# EAGLE design PCB-TLY-LAMP_v10-18 (EAGLE 7.7.0)
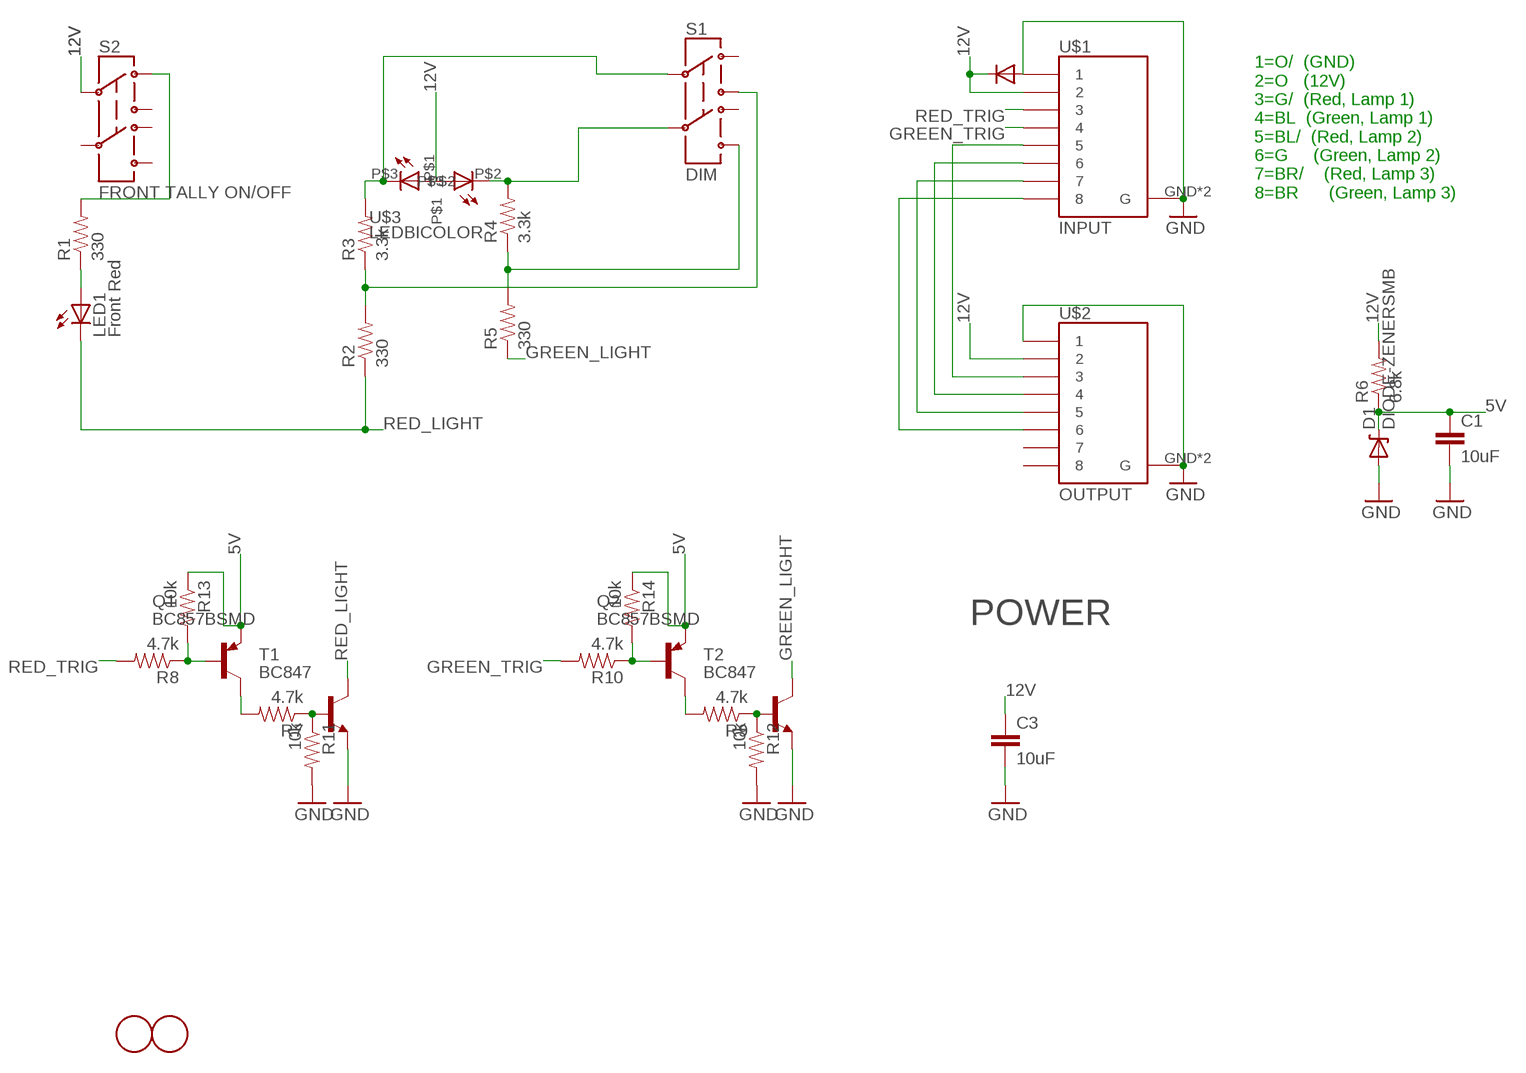
[diagram p0: schematic, sheet 1]

## Parts
C1  10uF  CAP0805  [0805]
C3  10uF  CAP0805  [0805]
D1  DIODE-ZENERSMB  [SMB-DIODE]
LED1  Front Red  LED20  [LED20]
Q1  BC857BSMD  [SOT23-BEC]
Q2  BC857BSMD  [SOT23-BEC]
R1  330  RESISTOR0603-RES  [0603-RES]
R2  330  RESISTOR0603-RES  [0603-RES]
R3  3.3k  RESISTOR0603-RES  [0603-RES]
R4  3.3k  RESISTOR0603-RES  [0603-RES]
R5  330  RESISTOR0603-RES  [0603-RES]
R6  6.8k  RESISTOR0603-RES  [0603-RES]
R7  4.7k  RESISTOR0603-RES  [0603-RES]
R8  4.7k  RESISTOR0603-RES  [0603-RES]
R9  4.7k  RESISTOR0603-RES  [0603-RES]
R10  4.7k  RESISTOR0603-RES  [0603-RES]
R11  10k  RESISTOR0603-RES  [0603-RES]
R12  10k  RESISTOR0603-RES  [0603-RES]
R13  10k  RESISTOR0603-RES  [0603-RES]
R14  10k  RESISTOR0603-RES  [0603-RES]
S1  DIM  SWITCH-DPDTPTH1  [TECONNECTIVITY-DPDT]
S2  FRONT TALLY ON/OFF  SWITCH-DPDTPTH1  [TECONNECTIVITY-DPDT]
T1  BC847  [SOT23]
T2  BC847  [SOT23]
U$1  INPUT  RJ45-8_GND  [RJ45-8_GND]
U$2  OUTPUT  RJ45-8_GND  [RJ45-8_GND]
U$3  LEDBICOLOR  [LEDBICOLOR]
U$4  FIDUCIAL  [FIDUCIAL_1MM]
U$5  FIDUCIAL  [FIDUCIAL_1MM]

## Nets
5V: C1.1 D1.C Q1.E Q2.E R6.1 R13.1 R14.1
12V [POWER]: C3.1 R6.2 S2.P$2 U$1.2 U$2.2 U$3.P$1
GND [POWER]: C1.2 C3.2 D1.A R11.2 R12.2 T1.2(E) T2.2(E) U$1.1 U$1.GND1(G) U$1.GND(G) U$2.1 U$2.GND1(G) U$2.GND(G)
GREEN_LIGHT [POWER]: R5.1 T2.3(C)
GREEN_TRIG: R10.2 U$1.4
N$1 [POWER]: R1.2 S2.P$1
N$2 [POWER]: LED1.P$1(A) R1.1
N$3 [POWER]: R2.2 R3.1 S1.P$3
N$4 [POWER]: R4.1 R5.2 S1.P$6
N$5 [POWER]: R4.2 S1.P$5 U$3.P$2
N$6 [POWER]: R3.2 S1.P$2 U$3.P$3
N$7: U$1.5 U$2.3
N$8: U$1.6 U$2.4
N$9: R7.1 R11.1 T1.1(B)
N$10: Q1.C R7.2
N$11: U$1.7 U$2.5
N$12: U$1.8 U$2.6
N$13: R9.1 R12.1 T2.1(B)
N$14: Q2.C R9.2
N$15: Q2.B R10.1 R14.2
N$16: Q1.B R8.1 R13.2
RED_LIGHT [POWER]: LED1.P$2(C) R2.1 T1.3(C)
RED_TRIG: R8.2 U$1.3
Unconnected: S1.P$1 S1.P$4 S2.P$3 S2.P$4 S2.P$5 S2.P$6 U$2.7 U$2.8

## Notes on the sheet
- 1=O/  (GND)
  2=O   (12V)
  3=G/  (Red, Lamp 1)
  4=BL  (Green, Lamp 1)
  5=BL/  (Red, Lamp 2)
  6=G     (Green, Lamp 2)
  7=BR/    (Red, Lamp 3)
  8=BR      (Green, Lamp 3)
- POWER

## Library data of the parts
C1 C3 = SparkFun:CAP: Capacitor Standard 0603 ceramic capacitor, and 0.1" leaded capacitor.
D1 = SparkFun:DIODE-ZENER: Zener Diode Production Part - 8199 3.4V Zener Voltage
LED1 = SKAARHOJ:LED20: KINGBRIGHT 20MM BIG LAMP
Q1 Q2 = transistor-pnp:BC857*: PNP Transistror
R1-R14 = SparkFun:RESISTOR: Resistor Basic schematic elements and footprints for 0603, 1206, and PTH resistors.
S1 S2 = SKAARHOJ:SWITCH-DPDT: DPDT Version of the COM-00597
T1 T2 = transistor:BC847: NPN TRANSISTOR
U$1 U$2 = SKAARHOJ:RJ45-8_GND
U$3 = SKAARHOJ:LEDBICOLOR: L.C.LED N810TGLR2D 10mm Diffused Bicolor Led Lamp (Anode)
U$4 U$5 = adafruit:FIDUCIAL: For use by pick and place machines to calibrate the vision/machine, 1mm By microbuilder.eu

## Net classes
0 default: width 0.254 mm, drill 0.559 mm, clearance 0.203 mm
1 POWER: width 0.508 mm, drill 0.686 mm, clearance 0.203 mm

## Board
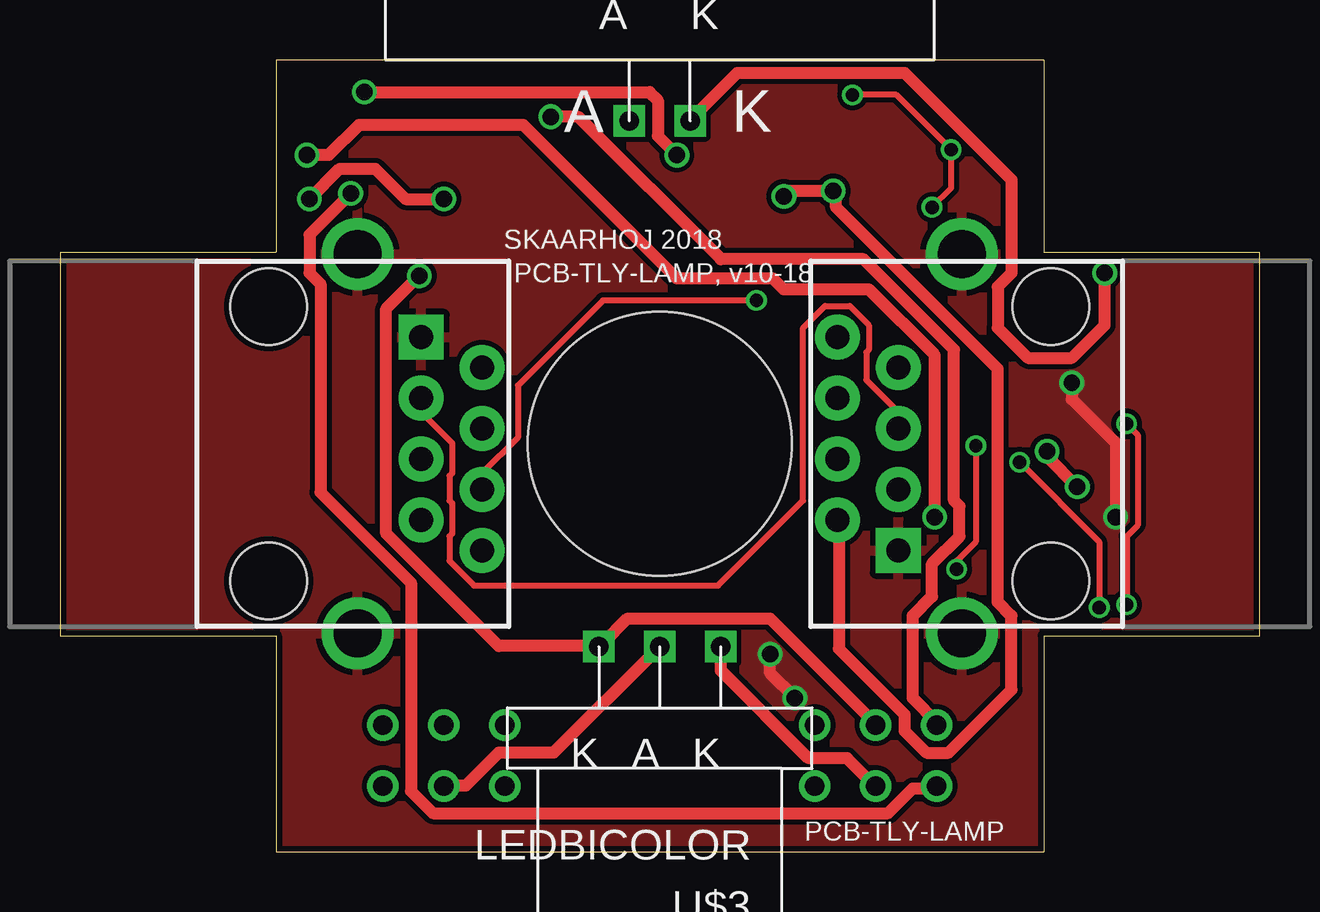
[diagram p1: board, top side]
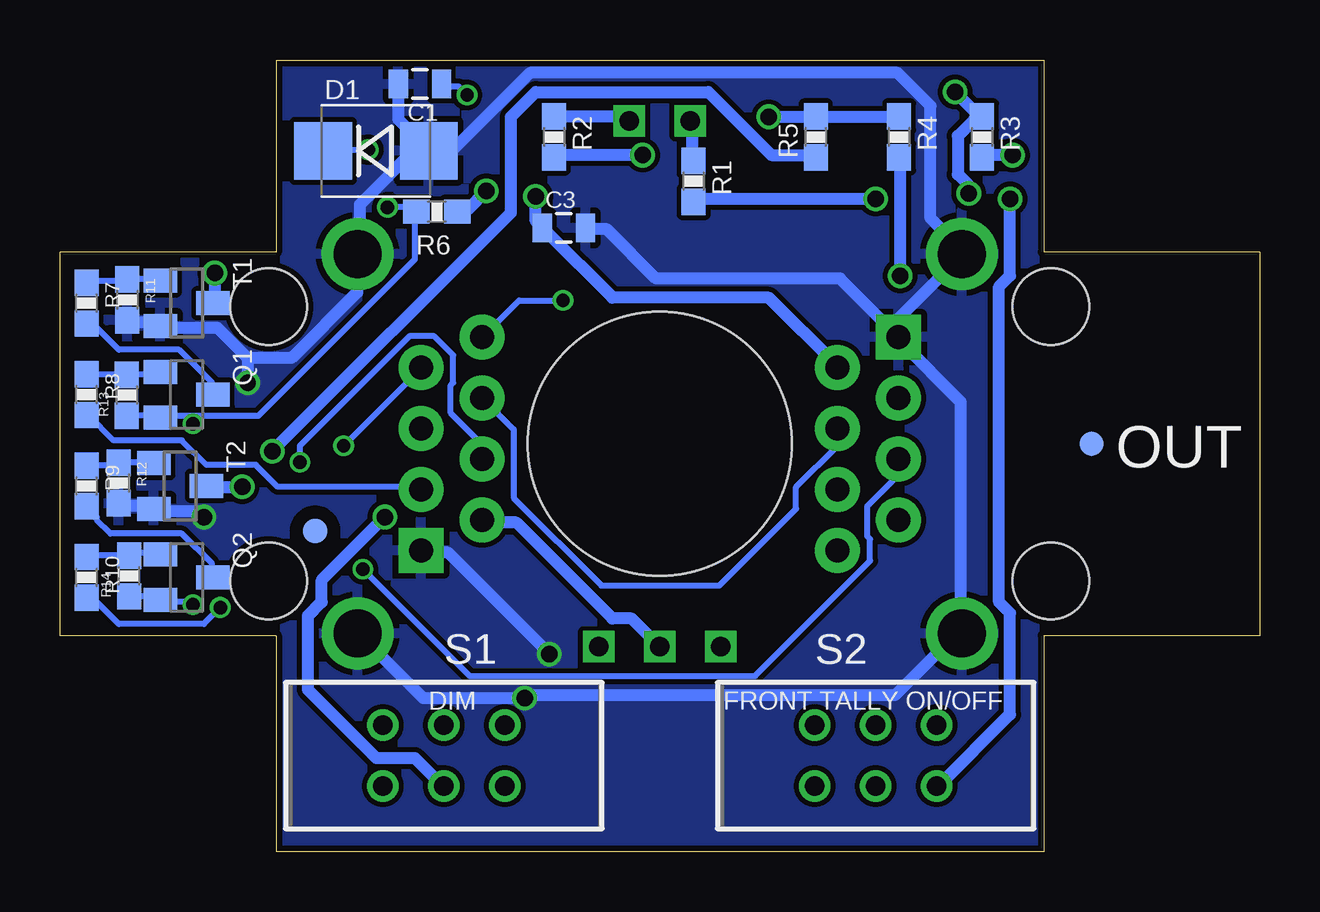
[diagram p2: board, bottom side, seen from below]

Size 50 x 33 mm. Coordinates in mm from the lower left corner, seen from the top.
Outline: 9,0 41,0 41,9 50,9 50,25 41,25 41,33 9,33 9,25 0,25 0,9 9,9 9,0
Copper layers (1*16): Top 0.035mm / dielectric 1.5mm / Bottom 0.035mm
Design rules "Fusion_eagle_rule_v1.1": minimum track width 6mil, minimum drill 12mil, track to track 6mil, track to pad 6mil, pad to pad 6mil, via to via 6mil, smd to smd 0mil, copper to edge 10mil, drill to drill 10mil, minimum pad ring 10mil, minimum via ring 6mil, stop-mask expansion 2mil, vias tented up to drill 100mil, thermal gap 10mil
Holes 11 mm at 25,17

### Footprints (pad centres in the part's own frame; a part is rotated, then mirrored left to right if it is on the bottom)
0805 = smd 0.8 x 1.2: 1 -0.9,0; 2 0.9,0
SMB-DIODE = smd 2.4 x 2.4: A 2.2,0; C -2.2,0
LED20 = drill 0.8 square: P$1 -1.27,-2.54; P$2 1.27,-2.54
SOT23-BEC = smd 1 x 1.4: B -0.95,-1.1; C 0,1.1; E 0.95,-1.1
0603-RES = smd 1.1 x 1: 1 -0.85,0; 2 0.85,0
TECONNECTIVITY-DPDT = drill 0.8: P$1 1.27,2.54; P$2 1.27,0; P$3 1.27,-2.54; P$4 -1.27,2.54; P$5 -1.27,0; P$6 -1.27,-2.54
SOT23 = smd 1 x 1.4: 1 -0.95,-1.1; 2 0.95,-1.1; 3 0,1.1
RJ45-8_GND = drill 1 pad 1.88 square: 1 -4.445,6.35 | drill 1 pad 1.88: 2 -3.175,8.89; 3 -1.905,6.35; 4 -0.635,8.89; 5 0.635,6.35; 6 1.905,8.89; 7 3.175,6.35; 8 4.445,8.89 | drill 2: GND -7.9,3.7; GND1 7.9,3.7 | hole 3.2: -5.715,0; 5.715,0
LEDBICOLOR = drill 0.8 square: P$1 0,-2.54; P$2 2.54,-2.54; P$3 -2.54,-2.54
FIDUCIAL_1MM = smd 1 x 1: 1 0,0

### Placement (x,y rotation side)
C1  35,32 180 bottom
C3  29,26 0 bottom
D1  36.83,29.21 0 bottom
LED1  25,33 0 top
Q1  44.72,19.05 270 bottom
Q2  44.72,11.43 270 bottom
R1  23.59,27.94 270 bottom
R2  29.41,29.79 270 bottom
R3  11.57,29.79 270 bottom
R4  15.03,29.79 270 bottom
R5  18.49,29.79 90 bottom
R6  34.29,26.67 0 bottom
R7  48.9,22.86 270 bottom
R8  48.9,19.05 270 bottom
R9  48.9,15.24 270 bottom
R10  48.9,11.43 270 bottom
R11  47.19,23 270 bottom
R12  47.55,15.37 270 bottom
R13  47.21,19.02 90 bottom
R14  47.12,11.48 90 bottom
S1  34,4 270 bottom
S2  16,4 270 bottom
T1  44.72,22.86 270 bottom
T2  44.99,15.24 270 bottom
U$1  41.3,17 90 top
U$2  8.7,17 270 top
U$3  25,6 180 top
U$4  39.37,13.37 0 bottom
U$5  7,17 0 bottom

### Tracks (layer width: path | path; a pad name or v marks a point on that pad's centre or on a via)
5V  (via drill 0.56)
  Top 0.254: v33.03,31.55 34.86,31.55 v37.15,29.26 37.15,27.66 v36.35,26.86 | v44.46,10.29 44.46,13.14 44.92,13.6 44.92,17.37 v44.46,17.83
  Bottom 0.254: v33.03,31.55 33.38,31.89 34.06,31.89 C1.1 | v37.15,29.26 38.98,29.26 D1.C | R14.1 47.09,10.63 45.95,10.63 45.83,10.52 Q2.E 45.72,10.4 44.58,10.4 v44.46,10.29 | R13.1 45.83,18.17 Q1.E 45.72,18.17 44.46,18.17 | 44.46,18.17 41.72,18.17 35.2,24.69 35.2,26.63 R6.1 35.32,26.63 35.55,26.86 v36.35,26.86 | 44.46,18.17 v44.46,17.83
12V  (via drill 0.69)
  Top 0.508: v30.18,27.32 30.4,27.55 v32.23,27.55 32.35,27.32 32.35,26.86 39.09,20.12 39.09,10.4 39.66,9.83 39.66,6.74 37.03,4.12 36.12,4.12 35.2,5.03 35.2,5.71 32.46,8.46 32.46,13.72 U$1.2 | S2.P$2 16,2.74 16.92,2.74 18.29,4.12 20.57,4.12 24.92,8.46 U$3.P$1
  Bottom 0.508: v32.23,27.55 33.03,26.75 33.38,26.75 R6.2 | v30.18,27.32 30.18,26.29 29.95,26.06 C3.1 29.72,25.83 26.98,23.09 20.46,23.09 17.6,20.23 U$2.2 | U$1.2 32.35,13.72 30.98,13.72 26.98,9.72 26.18,9.72 25.03,8.57 U$3.P$1
GND  (via drill 0.69)
  Top 0.508: v44.01,13.95 44.01,17.03 42.18,18.86 v42.18,19.55 | v29.6,8.23 29.6,7.43 v30.63,6.4
  Bottom 0.508: C1.2 35.89,31.89 35.89,30.52 34.63,29.26 D1.A | R12.2 47.55,14.4 46.18,14.4 T2.2 45.95,14.17 44.23,14.17 v44.01,13.95 | R11.2 47.09,22.06 45.95,22.06 45.83,21.95 T1.2 45.61,21.83 43.43,21.83 42.18,20.57 | 42.18,20.57 40.35,20.57 37.6,23.32 37.6,24.8 U$1.GND1 37.49,25.15 37.49,26.98 35.09,29.38 D1.A | 42.18,20.57 v42.18,19.55 | v29.6,8.23 33.83,12.46 34.86,12.46 U$1.1 | U$1.GND 37.49,9.03 34.86,6.4 v30.63,6.4 30.4,6.51 15.2,6.51 12.69,9.03 U$2.GND1 12.46,9.14 12.46,18.75 14.97,21.26 U$2.1 | C3.2 28,25.95 27.2,25.95 25.15,23.89 17.49,23.89 15.09,21.49 U$2.1 | U$2.1 15.32,21.95 12.46,24.8 U$2.GND 12.46,25.15 13.72,26.4 13.72,31.09 15.09,32.46 30.4,32.46 33.49,29.38 34.4,29.38 D1.A
  pour Top: 0,0 50,0 50,34 0,34
  pour Bottom: 0,0 50,0 50,34 0,34
GREEN_LIGHT  (via drill 0.69)
  Top 0.508: v41.15,16.69 41.15,16.46 v42.41,15.2
  Bottom 0.508: v41.15,16.69 31.2,26.63 31.2,30.63 30.18,31.66 22.97,31.66 20.34,29.03 18.52,29.03 R5.1 | v42.41,15.2 43.78,15.2 T2.3
GREEN_TRIG  (via drill 0.56)
  Top 0.254: v43.32,10.17 43.32,12.92 v40.01,16.23
  Bottom 0.254: v43.32,10.17 44.01,9.49 47.55,9.49 48.58,10.52 48.81,10.52 R10.2 | v40.01,16.23 40.01,16.92 35.43,21.49 34.4,21.49 33.6,20.69 33.6,19.55 33.72,19.43 33.72,18.29 32.46,17.03 32.46,16.46 U$1.4
N$1  (via drill 0.69)
  Top 0.508: v16,27.2 14.4,27.2 13.14,28.46 11.66,28.46 v10.4,27.2
  Bottom 0.508: v16,27.2 23.55,27.2 R1.2 | v10.4,27.2 10.4,24 10.86,23.55 10.86,10.4 10.4,9.94 10.4,5.71 13.37,2.74 S2.P$1
N$2
  Bottom 0.508: R1.1 23.66,28.8 23.66,30.4 LED1.P$1
N$3  (via drill 0.69)
  Top 0.508: v25.72,29.03 24.92,29.83 24.92,31.32 24.57,31.66 v12.69,31.66 | v12.12,27.43 10.4,25.72 10.4,24.12 10.86,23.66 10.86,14.97 14.63,11.2 14.63,2.52 15.54,1.6 34.52,1.6 35.55,2.63 36.46,2.63 S1.P$3
  Bottom 0.508: v25.72,29.03 29.38,29.03 R2.2 | v12.69,31.66 11.66,30.63 R3.1 11.89,30.52 12.57,29.83 12.57,28.23 12.12,27.77 v12.12,27.43
N$4  (via drill 0.69)
  Top 0.508: v20.46,30.63 21.6,30.63 27.55,24.69 33.49,24.69 37.26,20.92 37.26,14.63 37.49,14.4 37.49,13.14 36.35,12 36.35,10.63 35.55,9.83 35.55,6.4 36.58,5.37 S1.P$6
  Bottom 0.508: R4.1 15.09,30.63 18.4,30.63 R5.2 18.75,30.63 v20.46,30.63
N$5  (via drill 0.69)
  Top 0.508: v14.97,24 13.6,22.63 13.6,13.26 18.29,8.57 22.4,8.57 U$3.P$2 22.63,8.69 23.66,9.72 29.6,9.72 33.95,5.37 S1.P$5
  Bottom 0.508: v14.97,24 14.97,28.92 R4.2
N$6  (via drill 0.69)
  Top 0.508: v10.29,29.03 11.2,29.03 12.46,30.29 19.32,30.29 25.72,23.89 29.72,23.89 30.18,23.43 33.72,23.43 36.46,20.69 v36.46,13.95 | U$3.P$3 27.55,8.46 27.55,7.54 31.2,3.89 32.8,3.89 33.95,2.74 S1.P$2
  Bottom 0.508: v10.29,29.03 11.54,29.03 R3.2 | v36.46,13.95 39.09,11.32 39.09,10.4 39.66,9.83 39.66,6.74 36.8,3.89 35.2,3.89 34.06,2.74 S1.P$2
N$7
  Top 0.254: U$1.5 34.86,17.72 34.86,18.4 33.6,19.66 33.6,20.8 33.72,20.92 33.72,21.95 32.92,22.75 31.89,22.75 30.98,21.83 30.98,14.63 27.43,11.09 17.26,11.09 16.23,12.12 16.23,13.14 16.34,13.26 16.34,14.52 16.23,14.63 16.23,15.66 16.34,15.77 16.34,17.03 15.09,18.29 15.09,18.86 U$2.3
N$8
  Bottom 0.254: U$2.4 17.6,17.6 17.6,16.92 19.32,15.2 19.32,14.29 22.52,11.09 27.43,11.09 31.09,14.74 31.09,17.6 32.35,18.86 U$1.6
N$9
  Bottom 0.254: R7.1 48.81,23.77 47.21,23.77 R11.1 47.09,23.89 45.83,23.89 T1.1
N$10
  Bottom 0.254: R7.2 48.81,21.95 48.58,21.95 47.55,20.92 45.03,20.92 43.66,19.55 43.66,19.09 Q1.C
N$11  (via drill 0.56)
  Top 0.254: v37.38,11.77 37.38,12.12 38.18,12.92 v38.18,16.92
  Bottom 0.254: v37.38,11.77 32.92,7.32 21.03,7.32 16.23,12.12 16.23,13.03 16.34,13.14 16.34,14.4 15.09,15.66 15.09,16.34 U$2.5 | v38.18,16.92 34.98,20.12 U$1.7
N$12  (via drill 0.56)
  Top 0.254: v29.03,22.97 22.63,22.97 19.09,19.43 19.09,17.26 17.6,15.77 17.6,15.2 U$2.6
  Bottom 0.254: v29.03,22.97 30.86,22.97 32.35,21.49 U$1.8
N$13
  Bottom 0.254: R9.1 48.81,16.12 47.66,16.12 R12.1 47.43,16.23 46.18,16.23 T2.1
N$14
  Bottom 0.254: R9.2 48.81,14.29 48.46,13.95 48.46,13.83 47.89,13.26 44.92,13.26 43.66,12 43.66,11.43 Q2.C
N$15
  Bottom 0.254: R10.1 48.81,12.34 47.21,12.34 R14.2 47.09,12.46 45.83,12.46 Q2.B
N$16
  Bottom 0.254: Q1.B 45.83,19.89 R13.2 47.32,19.89 48.81,19.89 R8.1
RED_LIGHT  (via drill 0.69)
  Top 0.508: v43.55,24.12 43.55,21.95 42.18,20.57 40.35,20.57 39.09,21.83 39.09,23.55 39.66,24.12 39.66,28 35.2,32.46 28.23,32.46 26.29,30.52 LED1.P$2
  Bottom 0.508: R2.1 29.38,30.63 26.4,30.63 26.29,30.52 LED1.P$2 | v43.55,24.12 43.55,22.86 T1.3
RED_TRIG
  Bottom 0.254: R8.2 48.81,18.17 47.78,17.14 44.92,17.14 43.89,16.12 41.83,16.12 40.92,15.2 34.98,15.2 U$1.3

### Text on the board
_tsilk: A | K | SKAARHOJ 2018 | PCB-TLY-LAMP, v10-18 | PCB-TLY-LAMP
_bsilk: OUT